# Altium schematic sheet TOP_LEVEL.SchDoc
size A
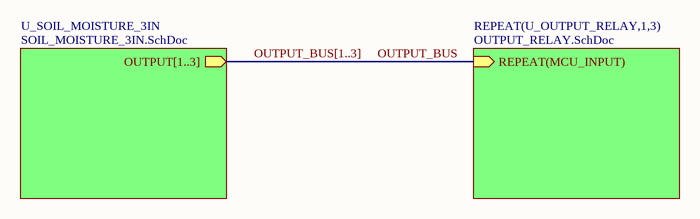
[diagram p0: TOP_LEVEL.SchDoc]

## Sub-sheets
REPEAT(U_OUTPUT_RELAY,1,3) = OUTPUT_RELAY.SchDoc: REPEAT(MCU_INPUT) (in)
U_SOIL_MOISTURE_3IN = SOIL_MOISTURE_3IN.SchDoc: OUTPUT[1..3] (out)

## Nets
OUTPUT_BUS: sheet REPEAT(U_OUTPUT_RELAY,1,3)/REPEAT(MCU_INPUT)

## Buses and harness runs
bus OUTPUT_BUS[1..3] = sheet U_SOIL_MOISTURE_3IN/OUTPUT[1..3]